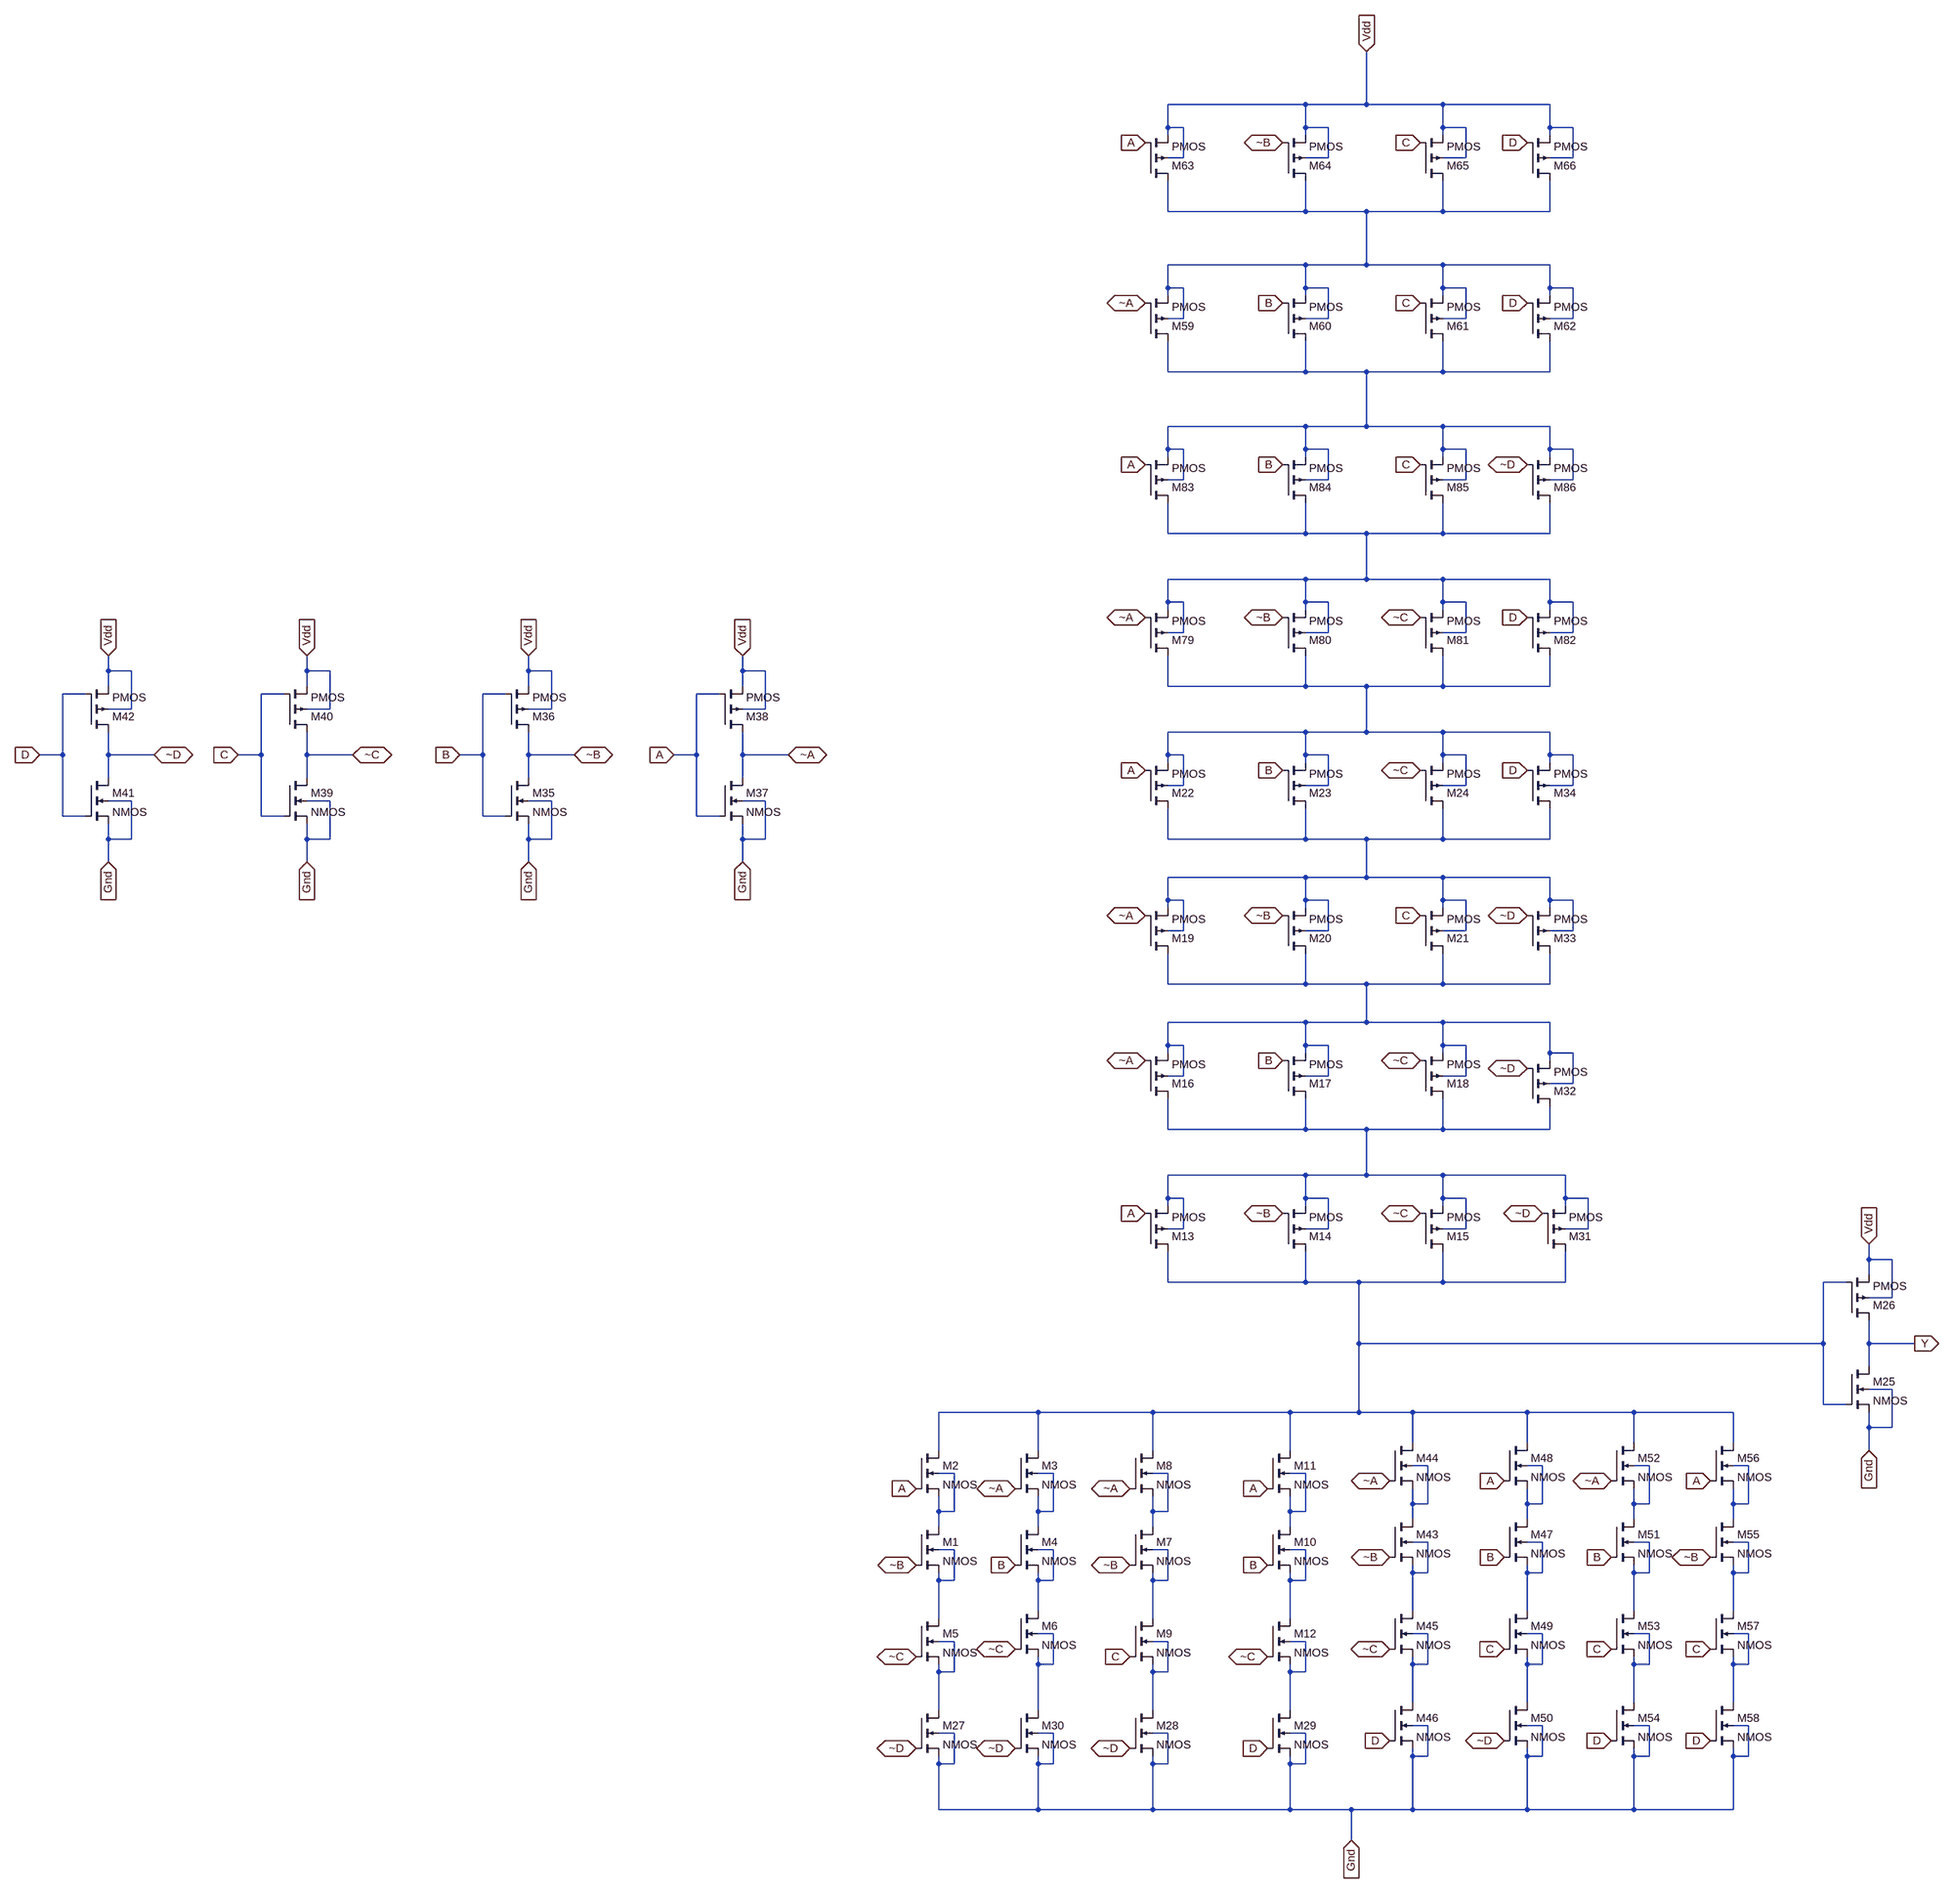
[diagram p0: schematic 4i_xor.asc]
4i_xor.asc, the LTspice schematic file:
Version 4
SHEET 1 2220 1336
WIRE -32 -2576 -320 -2576
WIRE 96 -2576 96 -2800
WIRE 96 -2576 -32 -2576
WIRE 256 -2576 96 -2576
WIRE 480 -2576 256 -2576
WIRE -320 -2528 -320 -2576
WIRE -288 -2528 -320 -2528
WIRE -32 -2528 -32 -2576
WIRE 16 -2528 -32 -2528
WIRE 256 -2528 256 -2576
WIRE 304 -2528 256 -2528
WIRE 480 -2528 480 -2576
WIRE 528 -2528 480 -2528
WIRE -320 -2512 -320 -2528
WIRE -32 -2512 -32 -2528
WIRE 256 -2512 256 -2528
WIRE 480 -2512 480 -2528
WIRE -288 -2464 -288 -2528
WIRE -288 -2464 -320 -2464
WIRE 16 -2464 16 -2528
WIRE 16 -2464 -32 -2464
WIRE 304 -2464 304 -2528
WIRE 304 -2464 256 -2464
WIRE 528 -2464 528 -2528
WIRE 528 -2464 480 -2464
WIRE -320 -2352 -320 -2416
WIRE -32 -2352 -32 -2416
WIRE -32 -2352 -320 -2352
WIRE 96 -2352 -32 -2352
WIRE 256 -2352 256 -2416
WIRE 256 -2352 96 -2352
WIRE 480 -2352 480 -2416
WIRE 480 -2352 256 -2352
WIRE -32 -2240 -320 -2240
WIRE 96 -2240 96 -2352
WIRE 96 -2240 -32 -2240
WIRE 256 -2240 96 -2240
WIRE 480 -2240 256 -2240
WIRE -320 -2192 -320 -2240
WIRE -288 -2192 -320 -2192
WIRE -32 -2192 -32 -2240
WIRE 16 -2192 -32 -2192
WIRE 256 -2192 256 -2240
WIRE 304 -2192 256 -2192
WIRE 480 -2192 480 -2240
WIRE 528 -2192 480 -2192
WIRE -320 -2176 -320 -2192
WIRE -32 -2176 -32 -2192
WIRE 256 -2176 256 -2192
WIRE 480 -2176 480 -2192
WIRE -288 -2128 -288 -2192
WIRE -288 -2128 -320 -2128
WIRE 16 -2128 16 -2192
WIRE 16 -2128 -32 -2128
WIRE 304 -2128 304 -2192
WIRE 304 -2128 256 -2128
WIRE 528 -2128 528 -2192
WIRE 528 -2128 480 -2128
WIRE -320 -2016 -320 -2080
WIRE -32 -2016 -32 -2080
WIRE -32 -2016 -320 -2016
WIRE 96 -2016 -32 -2016
WIRE 256 -2016 256 -2080
WIRE 256 -2016 96 -2016
WIRE 480 -2016 480 -2080
WIRE 480 -2016 256 -2016
WIRE -32 -1872 -320 -1872
WIRE 96 -1872 96 -2016
WIRE 96 -1872 -32 -1872
WIRE 256 -1872 96 -1872
WIRE 480 -1872 256 -1872
WIRE -320 -1824 -320 -1872
WIRE -288 -1824 -320 -1824
WIRE -32 -1824 -32 -1872
WIRE 16 -1824 -32 -1824
WIRE 256 -1824 256 -1872
WIRE 304 -1824 256 -1824
WIRE 480 -1824 480 -1872
WIRE 528 -1824 480 -1824
WIRE -320 -1808 -320 -1824
WIRE -32 -1808 -32 -1824
WIRE 256 -1808 256 -1824
WIRE 480 -1808 480 -1824
WIRE -288 -1760 -288 -1824
WIRE -288 -1760 -320 -1760
WIRE 16 -1760 16 -1824
WIRE 16 -1760 -32 -1760
WIRE 304 -1760 304 -1824
WIRE 304 -1760 256 -1760
WIRE 528 -1760 528 -1824
WIRE 528 -1760 480 -1760
WIRE -320 -1648 -320 -1712
WIRE -32 -1648 -32 -1712
WIRE -32 -1648 -320 -1648
WIRE 96 -1648 -32 -1648
WIRE 256 -1648 256 -1712
WIRE 256 -1648 96 -1648
WIRE 480 -1648 480 -1712
WIRE 480 -1648 256 -1648
WIRE -32 -1552 -320 -1552
WIRE 96 -1552 96 -1648
WIRE 96 -1552 -32 -1552
WIRE 256 -1552 96 -1552
WIRE 480 -1552 256 -1552
WIRE -320 -1504 -320 -1552
WIRE -288 -1504 -320 -1504
WIRE -32 -1504 -32 -1552
WIRE 16 -1504 -32 -1504
WIRE 256 -1504 256 -1552
WIRE 304 -1504 256 -1504
WIRE 480 -1504 480 -1552
WIRE 528 -1504 480 -1504
WIRE -320 -1488 -320 -1504
WIRE -32 -1488 -32 -1504
WIRE 256 -1488 256 -1504
WIRE 480 -1488 480 -1504
WIRE -288 -1440 -288 -1504
WIRE -288 -1440 -320 -1440
WIRE 16 -1440 16 -1504
WIRE 16 -1440 -32 -1440
WIRE 304 -1440 304 -1504
WIRE 304 -1440 256 -1440
WIRE 528 -1440 528 -1504
WIRE 528 -1440 480 -1440
WIRE -2896 -1360 -2896 -1392
WIRE -2848 -1360 -2896 -1360
WIRE -2480 -1360 -2480 -1392
WIRE -2432 -1360 -2480 -1360
WIRE -2016 -1360 -2016 -1392
WIRE -1968 -1360 -2016 -1360
WIRE -1568 -1360 -1568 -1392
WIRE -1520 -1360 -1568 -1360
WIRE -2896 -1328 -2896 -1360
WIRE -2480 -1328 -2480 -1360
WIRE -2016 -1328 -2016 -1360
WIRE -1568 -1328 -1568 -1360
WIRE -320 -1328 -320 -1392
WIRE -32 -1328 -32 -1392
WIRE -32 -1328 -320 -1328
WIRE 96 -1328 -32 -1328
WIRE 256 -1328 256 -1392
WIRE 256 -1328 96 -1328
WIRE 480 -1328 480 -1392
WIRE 480 -1328 256 -1328
WIRE -2944 -1312 -2992 -1312
WIRE -2528 -1312 -2576 -1312
WIRE -2064 -1312 -2112 -1312
WIRE -1616 -1312 -1664 -1312
WIRE -2848 -1280 -2848 -1360
WIRE -2848 -1280 -2896 -1280
WIRE -2432 -1280 -2432 -1360
WIRE -2432 -1280 -2480 -1280
WIRE -1968 -1280 -1968 -1360
WIRE -1968 -1280 -2016 -1280
WIRE -1520 -1280 -1520 -1360
WIRE -1520 -1280 -1568 -1280
WIRE -32 -1232 -320 -1232
WIRE 96 -1232 96 -1328
WIRE 96 -1232 -32 -1232
WIRE 256 -1232 96 -1232
WIRE 480 -1232 256 -1232
WIRE -2992 -1184 -2992 -1312
WIRE -2992 -1184 -3040 -1184
WIRE -2896 -1184 -2896 -1232
WIRE -2800 -1184 -2896 -1184
WIRE -2576 -1184 -2576 -1312
WIRE -2576 -1184 -2624 -1184
WIRE -2480 -1184 -2480 -1232
WIRE -2384 -1184 -2480 -1184
WIRE -2112 -1184 -2112 -1312
WIRE -2112 -1184 -2160 -1184
WIRE -2016 -1184 -2016 -1232
WIRE -1920 -1184 -2016 -1184
WIRE -1664 -1184 -1664 -1312
WIRE -1664 -1184 -1712 -1184
WIRE -1568 -1184 -1568 -1232
WIRE -1472 -1184 -1568 -1184
WIRE -320 -1184 -320 -1232
WIRE -288 -1184 -320 -1184
WIRE -32 -1184 -32 -1232
WIRE 16 -1184 -32 -1184
WIRE 256 -1184 256 -1232
WIRE 304 -1184 256 -1184
WIRE 480 -1184 480 -1232
WIRE 528 -1184 480 -1184
WIRE -320 -1168 -320 -1184
WIRE -32 -1168 -32 -1184
WIRE 256 -1168 256 -1184
WIRE 480 -1168 480 -1184
WIRE -2896 -1136 -2896 -1184
WIRE -2480 -1136 -2480 -1184
WIRE -2016 -1136 -2016 -1184
WIRE -1568 -1136 -1568 -1184
WIRE -288 -1120 -288 -1184
WIRE -288 -1120 -320 -1120
WIRE 16 -1120 16 -1184
WIRE 16 -1120 -32 -1120
WIRE 304 -1120 304 -1184
WIRE 304 -1120 256 -1120
WIRE 528 -1120 528 -1184
WIRE 528 -1120 480 -1120
WIRE -2848 -1088 -2896 -1088
WIRE -2432 -1088 -2480 -1088
WIRE -1968 -1088 -2016 -1088
WIRE -1520 -1088 -1568 -1088
WIRE -2992 -1056 -2992 -1184
WIRE -2944 -1056 -2992 -1056
WIRE -2576 -1056 -2576 -1184
WIRE -2528 -1056 -2576 -1056
WIRE -2112 -1056 -2112 -1184
WIRE -2064 -1056 -2112 -1056
WIRE -1664 -1056 -1664 -1184
WIRE -1616 -1056 -1664 -1056
WIRE -2896 -1008 -2896 -1040
WIRE -2848 -1008 -2848 -1088
WIRE -2848 -1008 -2896 -1008
WIRE -2480 -1008 -2480 -1040
WIRE -2432 -1008 -2432 -1088
WIRE -2432 -1008 -2480 -1008
WIRE -2016 -1008 -2016 -1040
WIRE -1968 -1008 -1968 -1088
WIRE -1968 -1008 -2016 -1008
WIRE -1568 -1008 -1568 -1040
WIRE -1520 -1008 -1520 -1088
WIRE -1520 -1008 -1568 -1008
WIRE -320 -1008 -320 -1072
WIRE -32 -1008 -32 -1072
WIRE -32 -1008 -320 -1008
WIRE 96 -1008 -32 -1008
WIRE 256 -1008 256 -1072
WIRE 256 -1008 96 -1008
WIRE 480 -1008 480 -1072
WIRE 480 -1008 256 -1008
WIRE -2896 -960 -2896 -1008
WIRE -2480 -960 -2480 -1008
WIRE -2016 -960 -2016 -1008
WIRE -1568 -960 -1568 -1008
WIRE -32 -928 -320 -928
WIRE 96 -928 96 -1008
WIRE 96 -928 -32 -928
WIRE 256 -928 96 -928
WIRE 480 -928 256 -928
WIRE -320 -880 -320 -928
WIRE -288 -880 -320 -880
WIRE -32 -880 -32 -928
WIRE 16 -880 -32 -880
WIRE 256 -880 256 -928
WIRE 304 -880 256 -880
WIRE 480 -880 480 -928
WIRE 528 -880 480 -880
WIRE -320 -864 -320 -880
WIRE -32 -864 -32 -880
WIRE 256 -864 256 -880
WIRE 480 -864 480 -880
WIRE -288 -816 -288 -880
WIRE -288 -816 -320 -816
WIRE 16 -816 16 -880
WIRE 16 -816 -32 -816
WIRE 304 -816 304 -880
WIRE 304 -816 256 -816
WIRE 528 -816 528 -880
WIRE 528 -816 480 -816
WIRE -320 -704 -320 -768
WIRE -32 -704 -32 -768
WIRE -32 -704 -320 -704
WIRE 96 -704 -32 -704
WIRE 256 -704 256 -768
WIRE 256 -704 96 -704
WIRE 480 -704 480 -768
WIRE 480 -704 256 -704
WIRE -32 -624 -320 -624
WIRE 96 -624 96 -704
WIRE 96 -624 -32 -624
WIRE 256 -624 96 -624
WIRE 480 -624 256 -624
WIRE -320 -576 -320 -624
WIRE -288 -576 -320 -576
WIRE -32 -576 -32 -624
WIRE 16 -576 -32 -576
WIRE 256 -576 256 -624
WIRE 304 -576 256 -576
WIRE -320 -560 -320 -576
WIRE -32 -560 -32 -576
WIRE 256 -560 256 -576
WIRE 480 -560 480 -624
WIRE 528 -560 480 -560
WIRE 480 -544 480 -560
WIRE -288 -512 -288 -576
WIRE -288 -512 -320 -512
WIRE 16 -512 16 -576
WIRE 16 -512 -32 -512
WIRE 304 -512 304 -576
WIRE 304 -512 256 -512
WIRE 528 -496 528 -560
WIRE 528 -496 480 -496
WIRE -320 -400 -320 -464
WIRE -32 -400 -32 -464
WIRE -32 -400 -320 -400
WIRE 96 -400 -32 -400
WIRE 256 -400 256 -464
WIRE 256 -400 96 -400
WIRE 480 -400 480 -448
WIRE 480 -400 256 -400
WIRE -32 -304 -320 -304
WIRE 96 -304 96 -400
WIRE 96 -304 -32 -304
WIRE 256 -304 96 -304
WIRE 512 -304 256 -304
WIRE -320 -256 -320 -304
WIRE -288 -256 -320 -256
WIRE -32 -256 -32 -304
WIRE 16 -256 -32 -256
WIRE 256 -256 256 -304
WIRE 304 -256 256 -256
WIRE 512 -256 512 -304
WIRE 560 -256 512 -256
WIRE -320 -240 -320 -256
WIRE -32 -240 -32 -256
WIRE 256 -240 256 -256
WIRE 512 -240 512 -256
WIRE -288 -192 -288 -256
WIRE -288 -192 -320 -192
WIRE 16 -192 16 -256
WIRE 16 -192 -32 -192
WIRE 304 -192 304 -256
WIRE 304 -192 256 -192
WIRE 560 -192 560 -256
WIRE 560 -192 512 -192
WIRE 1200 -128 1200 -160
WIRE 1248 -128 1200 -128
WIRE 1200 -96 1200 -128
WIRE -320 -80 -320 -144
WIRE -32 -80 -32 -144
WIRE -32 -80 -320 -80
WIRE 80 -80 -32 -80
WIRE 256 -80 256 -144
WIRE 256 -80 80 -80
WIRE 512 -80 512 -144
WIRE 512 -80 256 -80
WIRE 1152 -80 1104 -80
WIRE 1248 -48 1248 -128
WIRE 1248 -48 1200 -48
WIRE 80 48 80 -80
WIRE 1104 48 1104 -80
WIRE 1104 48 80 48
WIRE 1200 48 1200 0
WIRE 1296 48 1200 48
WIRE 1200 96 1200 48
WIRE 1248 144 1200 144
WIRE 1104 176 1104 48
WIRE 1152 176 1104 176
WIRE -592 192 -800 192
WIRE -352 192 -592 192
WIRE -64 192 -352 192
WIRE 80 192 80 48
WIRE 80 192 -64 192
WIRE 192 192 80 192
WIRE 432 192 192 192
WIRE 656 192 432 192
WIRE 864 192 656 192
WIRE 1200 224 1200 192
WIRE 1248 224 1248 144
WIRE 1248 224 1200 224
WIRE 192 256 192 192
WIRE 432 256 432 192
WIRE 656 256 656 192
WIRE 864 256 864 192
WIRE -800 272 -800 192
WIRE -592 272 -592 192
WIRE -352 272 -352 192
WIRE -64 272 -64 192
WIRE 1200 272 1200 224
WIRE 224 304 192 304
WIRE 464 304 432 304
WIRE 688 304 656 304
WIRE 896 304 864 304
WIRE -768 320 -800 320
WIRE -560 320 -592 320
WIRE -320 320 -352 320
WIRE -32 320 -64 320
WIRE 192 384 192 352
WIRE 224 384 224 304
WIRE 224 384 192 384
WIRE 432 384 432 352
WIRE 464 384 464 304
WIRE 464 384 432 384
WIRE 656 384 656 352
WIRE 688 384 688 304
WIRE 688 384 656 384
WIRE 864 384 864 352
WIRE 896 384 896 304
WIRE 896 384 864 384
WIRE -800 400 -800 368
WIRE -768 400 -768 320
WIRE -768 400 -800 400
WIRE -592 400 -592 368
WIRE -560 400 -560 320
WIRE -560 400 -592 400
WIRE -352 400 -352 368
WIRE -320 400 -320 320
WIRE -320 400 -352 400
WIRE -64 400 -64 368
WIRE -32 400 -32 320
WIRE -32 400 -64 400
WIRE 192 416 192 384
WIRE 432 416 432 384
WIRE 656 416 656 384
WIRE 864 416 864 384
WIRE -800 432 -800 400
WIRE -592 432 -592 400
WIRE -352 432 -352 400
WIRE -64 432 -64 400
WIRE 224 464 192 464
WIRE 464 464 432 464
WIRE 688 464 656 464
WIRE 896 464 864 464
WIRE -768 480 -800 480
WIRE -560 480 -592 480
WIRE -320 480 -352 480
WIRE -32 480 -64 480
WIRE 192 528 192 512
WIRE 224 528 224 464
WIRE 224 528 192 528
WIRE 432 528 432 512
WIRE 464 528 464 464
WIRE 464 528 432 528
WIRE 656 528 656 512
WIRE 688 528 688 464
WIRE 688 528 656 528
WIRE 864 528 864 512
WIRE 896 528 896 464
WIRE 896 528 864 528
WIRE -800 544 -800 528
WIRE -768 544 -768 480
WIRE -768 544 -800 544
WIRE -592 544 -592 528
WIRE -560 544 -560 480
WIRE -560 544 -592 544
WIRE -352 544 -352 528
WIRE -320 544 -320 480
WIRE -320 544 -352 544
WIRE -64 544 -64 528
WIRE -32 544 -32 480
WIRE -32 544 -64 544
WIRE -592 608 -592 544
WIRE 192 608 192 528
WIRE 432 608 432 528
WIRE 656 608 656 528
WIRE 864 608 864 528
WIRE -800 624 -800 544
WIRE -352 624 -352 544
WIRE -64 624 -64 544
WIRE -560 656 -592 656
WIRE 224 656 192 656
WIRE 464 656 432 656
WIRE 688 656 656 656
WIRE 896 656 864 656
WIRE -768 672 -800 672
WIRE -320 672 -352 672
WIRE -32 672 -64 672
WIRE -592 720 -592 704
WIRE -560 720 -560 656
WIRE -560 720 -592 720
WIRE 192 720 192 704
WIRE 224 720 224 656
WIRE 224 720 192 720
WIRE 432 720 432 704
WIRE 464 720 464 656
WIRE 464 720 432 720
WIRE 656 720 656 704
WIRE 688 720 688 656
WIRE 688 720 656 720
WIRE 864 720 864 704
WIRE 896 720 896 656
WIRE 896 720 864 720
WIRE -800 736 -800 720
WIRE -768 736 -768 672
WIRE -768 736 -800 736
WIRE -352 736 -352 720
WIRE -320 736 -320 672
WIRE -320 736 -352 736
WIRE -64 736 -64 720
WIRE -32 736 -32 672
WIRE -32 736 -64 736
WIRE 192 800 192 720
WIRE 432 800 432 720
WIRE 656 800 656 720
WIRE 864 800 864 720
WIRE -800 816 -800 736
WIRE -592 816 -592 720
WIRE -352 816 -352 736
WIRE -64 816 -64 736
WIRE 224 848 192 848
WIRE 464 848 432 848
WIRE 688 848 656 848
WIRE 896 848 864 848
WIRE -768 864 -800 864
WIRE -560 864 -592 864
WIRE -320 864 -352 864
WIRE -32 864 -64 864
WIRE 192 912 192 896
WIRE 224 912 224 848
WIRE 224 912 192 912
WIRE 432 912 432 896
WIRE 464 912 464 848
WIRE 464 912 432 912
WIRE 656 912 656 896
WIRE 688 912 688 848
WIRE 688 912 656 912
WIRE 864 912 864 896
WIRE 896 912 896 848
WIRE 896 912 864 912
WIRE -800 928 -800 912
WIRE -768 928 -768 864
WIRE -768 928 -800 928
WIRE -592 928 -592 912
WIRE -560 928 -560 864
WIRE -560 928 -592 928
WIRE -352 928 -352 912
WIRE -320 928 -320 864
WIRE -320 928 -352 928
WIRE -64 928 -64 912
WIRE -32 928 -32 864
WIRE -32 928 -64 928
WIRE -800 1024 -800 928
WIRE -592 1024 -592 928
WIRE -592 1024 -800 1024
WIRE -352 1024 -352 928
WIRE -352 1024 -592 1024
WIRE -64 1024 -64 928
WIRE -64 1024 -352 1024
WIRE 64 1024 -64 1024
WIRE 192 1024 192 912
WIRE 192 1024 64 1024
WIRE 432 1024 432 912
WIRE 432 1024 192 1024
WIRE 656 1024 656 912
WIRE 656 1024 432 1024
WIRE 864 1024 864 912
WIRE 864 1024 656 1024
WIRE 64 1088 64 1024
FLAG -848 352 A
IOPIN -848 352 In
FLAG -848 512 ~B
IOPIN -848 512 BiDir
FLAG -640 352 ~A
IOPIN -640 352 BiDir
FLAG -640 512 B
IOPIN -640 512 In
FLAG -848 704 ~C
IOPIN -848 704 BiDir
FLAG -640 688 ~C
IOPIN -640 688 BiDir
FLAG -400 352 ~A
IOPIN -400 352 BiDir
FLAG -400 512 ~B
IOPIN -400 512 BiDir
FLAG -400 704 C
IOPIN -400 704 In
FLAG -112 352 A
IOPIN -112 352 In
FLAG -112 512 B
IOPIN -112 512 In
FLAG -112 704 ~C
IOPIN -112 704 BiDir
FLAG -368 -224 A
IOPIN -368 -224 In
FLAG -80 -224 ~B
IOPIN -80 -224 BiDir
FLAG 208 -224 ~C
IOPIN 208 -224 BiDir
FLAG -368 -544 ~A
IOPIN -368 -544 BiDir
FLAG -80 -544 B
IOPIN -80 -544 In
FLAG 208 -544 ~C
IOPIN 208 -544 BiDir
FLAG -368 -848 ~A
IOPIN -368 -848 BiDir
FLAG -80 -848 ~B
IOPIN -80 -848 BiDir
FLAG 208 -848 C
IOPIN 208 -848 In
FLAG -368 -1152 A
IOPIN -368 -1152 In
FLAG -80 -1152 B
IOPIN -80 -1152 In
FLAG 208 -1152 ~C
IOPIN 208 -1152 BiDir
FLAG 64 1088 Gnd
IOPIN 64 1088 In
FLAG 1200 -160 Vdd
IOPIN 1200 -160 In
FLAG 1296 48 Y
IOPIN 1296 48 Out
FLAG 1200 272 Gnd
IOPIN 1200 272 In
FLAG -848 896 ~D
IOPIN -848 896 BiDir
FLAG -400 896 ~D
IOPIN -400 896 BiDir
FLAG -112 896 D
IOPIN -112 896 In
FLAG -640 896 ~D
IOPIN -640 896 BiDir
FLAG 464 -224 ~D
IOPIN 464 -224 BiDir
FLAG 432 -528 ~D
IOPIN 432 -528 BiDir
FLAG 432 -848 ~D
IOPIN 432 -848 BiDir
FLAG 432 -1152 D
IOPIN 432 -1152 In
FLAG -2016 -1392 Vdd
IOPIN -2016 -1392 In
FLAG -2160 -1184 B
IOPIN -2160 -1184 In
FLAG -1920 -1184 ~B
IOPIN -1920 -1184 BiDir
FLAG -1568 -1392 Vdd
IOPIN -1568 -1392 In
FLAG -1712 -1184 A
IOPIN -1712 -1184 In
FLAG -1472 -1184 ~A
IOPIN -1472 -1184 BiDir
FLAG -2016 -960 Gnd
IOPIN -2016 -960 In
FLAG -1568 -960 Gnd
IOPIN -1568 -960 In
FLAG -2480 -1392 Vdd
IOPIN -2480 -1392 In
FLAG -2624 -1184 C
IOPIN -2624 -1184 In
FLAG -2384 -1184 ~C
IOPIN -2384 -1184 BiDir
FLAG -2480 -960 Gnd
IOPIN -2480 -960 In
FLAG -2896 -1392 Vdd
IOPIN -2896 -1392 In
FLAG -3040 -1184 D
IOPIN -3040 -1184 In
FLAG -2800 -1184 ~D
IOPIN -2800 -1184 BiDir
FLAG -2896 -960 Gnd
IOPIN -2896 -960 In
FLAG 144 336 ~A
IOPIN 144 336 BiDir
FLAG 144 496 ~B
IOPIN 144 496 BiDir
FLAG 144 688 ~C
IOPIN 144 688 BiDir
FLAG 144 880 D
IOPIN 144 880 In
FLAG 384 336 A
IOPIN 384 336 In
FLAG 384 496 B
IOPIN 384 496 In
FLAG 384 688 C
IOPIN 384 688 In
FLAG 384 880 ~D
IOPIN 384 880 BiDir
FLAG 608 336 ~A
IOPIN 608 336 BiDir
FLAG 608 496 B
IOPIN 608 496 In
FLAG 608 688 C
IOPIN 608 688 In
FLAG 608 880 D
IOPIN 608 880 In
FLAG 816 336 A
IOPIN 816 336 In
FLAG 816 496 ~B
IOPIN 816 496 BiDir
FLAG 816 688 C
IOPIN 816 688 In
FLAG 816 880 D
IOPIN 816 880 In
FLAG -368 -1472 ~A
IOPIN -368 -1472 BiDir
FLAG -80 -1472 ~B
IOPIN -80 -1472 BiDir
FLAG 208 -1472 ~C
IOPIN 208 -1472 BiDir
FLAG 432 -1472 D
IOPIN 432 -1472 In
FLAG -368 -1792 A
IOPIN -368 -1792 In
FLAG -80 -1792 B
IOPIN -80 -1792 In
FLAG 208 -1792 C
IOPIN 208 -1792 In
FLAG 432 -1792 ~D
IOPIN 432 -1792 BiDir
FLAG -368 -2160 ~A
IOPIN -368 -2160 BiDir
FLAG -80 -2160 B
IOPIN -80 -2160 In
FLAG 208 -2160 C
IOPIN 208 -2160 In
FLAG 432 -2160 D
IOPIN 432 -2160 In
FLAG -368 -2496 A
IOPIN -368 -2496 In
FLAG -80 -2496 ~B
IOPIN -80 -2496 BiDir
FLAG 208 -2496 C
IOPIN 208 -2496 In
FLAG 432 -2496 D
IOPIN 432 -2496 In
FLAG 96 -2800 Vdd
IOPIN 96 -2800 In
SYMBOL nmos4 -848 432 R0
SYMATTR InstName M1
SYMBOL nmos4 -848 272 R0
SYMATTR InstName M2
SYMBOL nmos4 -640 272 R0
SYMATTR InstName M3
SYMBOL nmos4 -640 432 R0
SYMATTR InstName M4
SYMBOL nmos4 -848 624 R0
SYMATTR InstName M5
SYMBOL nmos4 -640 608 R0
SYMATTR InstName M6
SYMBOL nmos4 -400 432 R0
SYMATTR InstName M7
SYMBOL nmos4 -400 272 R0
SYMATTR InstName M8
SYMBOL nmos4 -400 624 R0
SYMATTR InstName M9
SYMBOL nmos4 -112 432 R0
SYMATTR InstName M10
SYMBOL nmos4 -112 272 R0
SYMATTR InstName M11
SYMBOL nmos4 -112 624 R0
SYMATTR InstName M12
SYMBOL pmos4 -368 -144 M180
SYMATTR InstName M13
SYMBOL pmos4 -80 -144 M180
SYMATTR InstName M14
SYMBOL pmos4 208 -144 M180
SYMATTR InstName M15
SYMBOL pmos4 -368 -464 M180
SYMATTR InstName M16
SYMBOL pmos4 -80 -464 M180
SYMATTR InstName M17
SYMBOL pmos4 208 -464 M180
SYMATTR InstName M18
SYMBOL pmos4 -368 -768 M180
SYMATTR InstName M19
SYMBOL pmos4 -80 -768 M180
SYMATTR InstName M20
SYMBOL pmos4 208 -768 M180
SYMATTR InstName M21
SYMBOL pmos4 -368 -1072 M180
SYMATTR InstName M22
SYMBOL pmos4 -80 -1072 M180
SYMATTR InstName M23
SYMBOL pmos4 208 -1072 M180
SYMATTR InstName M24
SYMBOL nmos4 1152 96 R0
SYMATTR InstName M25
SYMBOL pmos4 1152 0 M180
SYMATTR InstName M26
SYMBOL nmos4 -848 816 R0
SYMATTR InstName M27
SYMBOL nmos4 -400 816 R0
SYMATTR InstName M28
SYMBOL nmos4 -112 816 R0
SYMATTR InstName M29
SYMBOL nmos4 -640 816 R0
SYMATTR InstName M30
SYMBOL pmos4 464 -144 M180
SYMATTR InstName M31
SYMBOL pmos4 432 -448 M180
SYMATTR InstName M32
SYMBOL pmos4 432 -768 M180
SYMATTR InstName M33
SYMBOL pmos4 432 -1072 M180
SYMATTR InstName M34
SYMBOL nmos4 -2064 -1136 R0
SYMATTR InstName M35
SYMBOL pmos4 -2064 -1232 M180
SYMATTR InstName M36
SYMBOL nmos4 -1616 -1136 R0
SYMATTR InstName M37
SYMBOL pmos4 -1616 -1232 M180
SYMATTR InstName M38
SYMBOL nmos4 -2528 -1136 R0
SYMATTR InstName M39
SYMBOL pmos4 -2528 -1232 M180
SYMATTR InstName M40
SYMBOL nmos4 -2944 -1136 R0
SYMATTR InstName M41
SYMBOL pmos4 -2944 -1232 M180
SYMATTR InstName M42
SYMBOL nmos4 144 416 R0
SYMATTR InstName M43
SYMBOL nmos4 144 256 R0
SYMATTR InstName M44
SYMBOL nmos4 144 608 R0
SYMATTR InstName M45
SYMBOL nmos4 144 800 R0
SYMATTR InstName M46
SYMBOL nmos4 384 416 R0
SYMATTR InstName M47
SYMBOL nmos4 384 256 R0
SYMATTR InstName M48
SYMBOL nmos4 384 608 R0
SYMATTR InstName M49
SYMBOL nmos4 384 800 R0
SYMATTR InstName M50
SYMBOL nmos4 608 416 R0
SYMATTR InstName M51
SYMBOL nmos4 608 256 R0
SYMATTR InstName M52
SYMBOL nmos4 608 608 R0
SYMATTR InstName M53
SYMBOL nmos4 608 800 R0
SYMATTR InstName M54
SYMBOL nmos4 816 416 R0
SYMATTR InstName M55
SYMBOL nmos4 816 256 R0
SYMATTR InstName M56
SYMBOL nmos4 816 608 R0
SYMATTR InstName M57
SYMBOL nmos4 816 800 R0
SYMATTR InstName M58
SYMBOL pmos4 -368 -1392 M180
SYMATTR InstName M79
SYMBOL pmos4 -80 -1392 M180
SYMATTR InstName M80
SYMBOL pmos4 208 -1392 M180
SYMATTR InstName M81
SYMBOL pmos4 432 -1392 M180
SYMATTR InstName M82
SYMBOL pmos4 -368 -1712 M180
SYMATTR InstName M83
SYMBOL pmos4 -80 -1712 M180
SYMATTR InstName M84
SYMBOL pmos4 208 -1712 M180
SYMATTR InstName M85
SYMBOL pmos4 432 -1712 M180
SYMATTR InstName M86
SYMBOL pmos4 -368 -2080 M180
SYMATTR InstName M59
SYMBOL pmos4 -80 -2080 M180
SYMATTR InstName M60
SYMBOL pmos4 208 -2080 M180
SYMATTR InstName M61
SYMBOL pmos4 432 -2080 M180
SYMATTR InstName M62
SYMBOL pmos4 -368 -2416 M180
SYMATTR InstName M63
SYMBOL pmos4 -80 -2416 M180
SYMATTR InstName M64
SYMBOL pmos4 208 -2416 M180
SYMATTR InstName M65
SYMBOL pmos4 432 -2416 M180
SYMATTR InstName M66

The netlist it stands for:
* 4i_xor.asc
M1 N013 ~B N021 N021 NMOS
M2 N008 A N013 N013 NMOS
M3 N008 ~A N014 N014 NMOS
M4 N014 B N022 N022 NMOS
M5 N021 ~C N030 N030 NMOS
M6 N022 ~C N025 N025 NMOS
M7 N015 ~B N023 N023 NMOS
M8 N008 ~A N015 N015 NMOS
M9 N023 C N031 N031 NMOS
M10 N016 B N024 N024 NMOS
M11 N008 A N016 N016 NMOS
M12 N024 ~C N032 N032 NMOS
M13 N008 A N007 N007 PMOS
M14 N008 ~B N007 N007 PMOS
M15 N008 ~C N007 N007 PMOS
M16 N007 ~A N006 N006 PMOS
M17 N007 B N006 N006 PMOS
M18 N007 ~C N006 N006 PMOS
M19 N006 ~A N005 N005 PMOS
M20 N006 ~B N005 N005 PMOS
M21 N006 C N005 N005 PMOS
M22 N005 A N004 N004 PMOS
M23 N005 B N004 N004 PMOS
M24 N005 ~C N004 N004 PMOS
M25 Y N008 Gnd Gnd NMOS
M26 Y N008 Vdd Vdd PMOS
M27 N030 ~D Gnd Gnd NMOS
M28 N031 ~D Gnd Gnd NMOS
M29 N032 D Gnd Gnd NMOS
M30 N025 ~D Gnd Gnd NMOS
M31 N008 ~D N007 N007 PMOS
M32 N007 ~D N006 N006 PMOS
M33 N006 ~D N005 N005 PMOS
M34 N005 D N004 N004 PMOS
M35 ~B B Gnd Gnd NMOS
M36 ~B B Vdd Vdd PMOS
M37 ~A A Gnd Gnd NMOS
M38 ~A A Vdd Vdd PMOS
M39 ~C C Gnd Gnd NMOS
M40 ~C C Vdd Vdd PMOS
M41 ~D D Gnd Gnd NMOS
M42 ~D D Vdd Vdd PMOS
M43 N009 ~B N017 N017 NMOS
M44 N008 ~A N009 N009 NMOS
M45 N017 ~C N026 N026 NMOS
M46 N026 D Gnd Gnd NMOS
M47 N010 B N018 N018 NMOS
M48 N008 A N010 N010 NMOS
M49 N018 C N027 N027 NMOS
M50 N027 ~D Gnd Gnd NMOS
M51 N011 B N019 N019 NMOS
M52 N008 ~A N011 N011 NMOS
M53 N019 C N028 N028 NMOS
M54 N028 D Gnd Gnd NMOS
M55 N012 ~B N020 N020 NMOS
M56 N008 A N012 N012 NMOS
M57 N020 C N029 N029 NMOS
M58 N029 D Gnd Gnd NMOS
M79 N004 ~A N003 N003 PMOS
M80 N004 ~B N003 N003 PMOS
M81 N004 ~C N003 N003 PMOS
M82 N004 D N003 N003 PMOS
M83 N003 A N002 N002 PMOS
M84 N003 B N002 N002 PMOS
M85 N003 C N002 N002 PMOS
M86 N003 ~D N002 N002 PMOS
M59 N002 ~A N001 N001 PMOS
M60 N002 B N001 N001 PMOS
M61 N002 C N001 N001 PMOS
M62 N002 D N001 N001 PMOS
M63 N001 A Vdd Vdd PMOS
M64 N001 ~B Vdd Vdd PMOS
M65 N001 C Vdd Vdd PMOS
M66 N001 D Vdd Vdd PMOS
.model NMOS NMOS
.model PMOS PMOS
.lib standard.mos
.backanno
.end